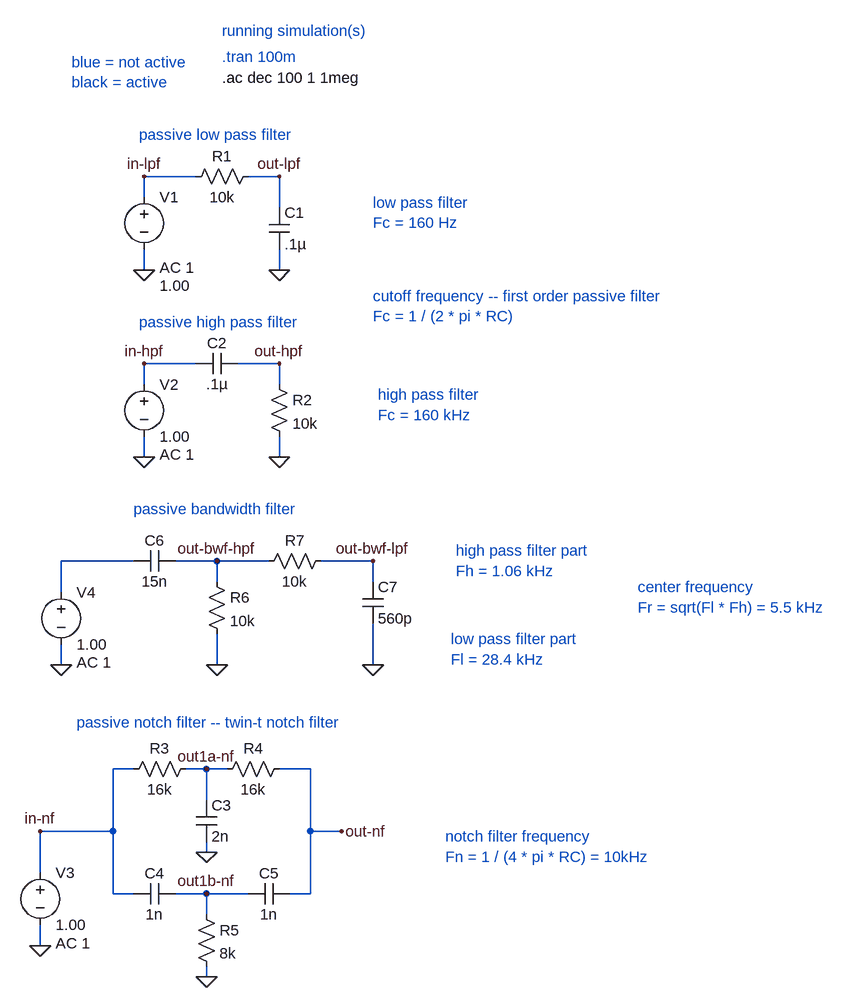
[diagram p0: schematic basic-passive-filters.asc]
basic-passive-filters.asc, the LTspice schematic file:
Version 4.1
SHEET 1 1164 1828
WIRE 144 64 64 64
WIRE 272 64 224 64
WIRE 64 96 64 64
WIRE 272 112 272 64
WIRE 64 208 64 176
WIRE 272 208 272 176
WIRE 144 352 64 352
WIRE 272 352 208 352
WIRE 64 384 64 352
WIRE 272 384 272 352
WIRE 64 496 64 464
WIRE 272 496 272 464
WIRE 48 656 -64 656
WIRE 176 656 112 656
WIRE 256 656 176 656
WIRE 416 656 336 656
WIRE 176 688 176 656
WIRE 416 688 416 656
WIRE -64 704 -64 656
WIRE -64 816 -64 784
WIRE 176 816 176 768
WIRE 416 816 416 752
WIRE 48 976 16 976
WIRE 160 976 128 976
WIRE 192 976 160 976
WIRE 320 976 272 976
WIRE 160 1024 160 976
WIRE 16 1072 16 976
WIRE 16 1072 -96 1072
WIRE 320 1072 320 976
WIRE 368 1072 320 1072
WIRE 160 1104 160 1088
WIRE -96 1136 -96 1072
WIRE 16 1168 16 1072
WIRE 48 1168 16 1168
WIRE 160 1168 112 1168
WIRE 224 1168 160 1168
WIRE 320 1168 320 1072
WIRE 320 1168 288 1168
WIRE 160 1200 160 1168
WIRE -96 1248 -96 1216
WIRE 160 1296 160 1280
FLAG 64 208 0
FLAG 272 208 0
FLAG 272 64 out-lpf
FLAG 64 496 0
FLAG 272 496 0
FLAG 272 352 out-hpf
FLAG 64 64 in-lpf
FLAG 64 352 in-hpf
FLAG 160 1104 0
FLAG 160 1296 0
FLAG -96 1248 0
FLAG 368 1072 out-nf
FLAG -96 1072 in-nf
FLAG 160 976 out1a-nf
FLAG 160 1168 out1b-nf
FLAG -64 816 0
FLAG 176 816 0
FLAG 416 816 0
FLAG 416 656 out-bwf-lpf
FLAG 176 656 out-bwf-hpf
SYMBOL voltage 64 80 R0
WINDOW 3 24 152 Left 2
WINDOW 123 24 124 Left 2
WINDOW 39 0 0 Left 0
SYMATTR InstName V1
SYMATTR Value 1.00
SYMATTR Value2 AC 1
SYMBOL res 240 48 R90
WINDOW 0 0 56 VBottom 2
WINDOW 3 32 56 VTop 2
SYMATTR InstName R1
SYMATTR Value 10k
SYMBOL cap 256 112 R0
SYMATTR InstName C1
SYMATTR Value .1µ
SYMBOL voltage 64 368 R0
WINDOW 123 24 124 Left 2
WINDOW 39 0 0 Left 0
SYMATTR InstName V2
SYMATTR Value 1.00
SYMATTR Value2 AC 1
SYMBOL cap 208 336 R90
WINDOW 0 0 32 VBottom 2
WINDOW 3 32 32 VTop 2
SYMATTR InstName C2
SYMATTR Value .1µ
SYMBOL res 256 368 R0
SYMATTR InstName R2
SYMATTR Value 10k
SYMBOL voltage -96 1120 R0
WINDOW 123 24 124 Left 2
WINDOW 39 0 0 Left 0
SYMATTR InstName V3
SYMATTR Value 1.00
SYMATTR Value2 AC 1
SYMBOL res 144 960 R90
WINDOW 0 0 56 VBottom 2
WINDOW 3 32 56 VTop 2
SYMATTR InstName R3
SYMATTR Value 16k
SYMBOL res 288 960 R90
WINDOW 0 0 56 VBottom 2
WINDOW 3 32 56 VTop 2
SYMATTR InstName R4
SYMATTR Value 16k
SYMBOL cap 144 1024 R0
SYMATTR InstName C3
SYMATTR Value 2n
SYMBOL cap 112 1152 R90
WINDOW 0 0 32 VBottom 2
WINDOW 3 32 32 VTop 2
SYMATTR InstName C4
SYMATTR Value 1n
SYMBOL cap 288 1152 R90
WINDOW 0 0 32 VBottom 2
WINDOW 3 32 32 VTop 2
SYMATTR InstName C5
SYMATTR Value 1n
SYMBOL res 144 1184 R0
SYMATTR InstName R5
SYMATTR Value 8k
SYMBOL voltage -64 688 R0
WINDOW 123 24 124 Left 2
WINDOW 39 0 0 Left 0
SYMATTR InstName V4
SYMATTR Value 1.00
SYMATTR Value2 AC 1
SYMBOL cap 112 640 R90
WINDOW 0 0 32 VBottom 2
WINDOW 3 32 32 VTop 2
SYMATTR InstName C6
SYMATTR Value 15n
SYMBOL res 160 672 R0
SYMATTR InstName R6
SYMATTR Value 10k
SYMBOL res 352 640 R90
WINDOW 0 0 56 VBottom 2
WINDOW 3 32 56 VTop 2
SYMATTR InstName R7
SYMATTR Value 10k
SYMBOL cap 400 688 R0
SYMATTR InstName C7
SYMATTR Value 560p
TEXT 56 0 Left 2 ;passive low pass filter
TEXT 56 288 Left 2 ;passive high pass filter
TEXT -40 904 Left 2 ;passive notch filter -- twin-t notch filter
TEXT 184 -120 Left 2 ;.tran 100m
TEXT 184 -160 Left 2 ;running simulation(s)
TEXT 184 -88 Left 2 !.ac dec 100 1 1meg
TEXT 48 576 Left 2 ;passive bandwidth filter
TEXT -48 -112 Left 2 ;blue = not active\nblack = active
TEXT 416 248 Left 2 ;cutoff frequency -- first order passive filter\nFc = 1 / (2 * pi * RC)
TEXT 824 696 Left 2 ;center frequency\nFr = sqrt(Fl * Fh) = 5.5 kHz
TEXT 528 1080 Left 2 ;notch filter frequency\nFn = 1 / (4 * pi * RC) = 10kHz
TEXT 416 104 Left 2 ;low pass filter\nFc = 160 Hz
TEXT 424 400 Left 2 ;high pass filter\nFc = 160 kHz
TEXT 544 640 Left 2 ;high pass filter part\nFh = 1.06 kHz
TEXT 536 776 Left 2 ;low pass filter part\nFl = 28.4 kHz

The netlist it stands for:
* basic-passive-filters.asc
V1 in-lpf 0 1.00 AC 1
R1 out-lpf in-lpf 10k
C1 out-lpf 0 .1µ
V2 in-hpf 0 1.00 AC 1
C2 out-hpf in-hpf .1µ
R2 out-hpf 0 10k
V3 in-nf 0 1.00 AC 1
R3 out1a-nf in-nf 16k
R4 out-nf out1a-nf 16k
C3 out1a-nf 0 2n
C4 out1b-nf in-nf 1n
C5 out-nf out1b-nf 1n
R5 out1b-nf 0 8k
V4 N001 0 1.00 AC 1
C6 out-bwf-hpf N001 15n
R6 out-bwf-hpf 0 10k
R7 out-bwf-lpf out-bwf-hpf 10k
C7 out-bwf-lpf 0 560p
* passive low pass filter
* passive high pass filter
* passive notch filter -- twin-t notch filter
* .tran 100m
* running simulation(s)
.ac dec 100 1 1meg
* passive bandwidth filter
* blue = not active
* black = active
* cutoff frequency -- first order passive filter
* Fc = 1 / (2 * pi * RC)
* center frequency
* Fr = sqrt(Fl * Fh) = 5.5 kHz
* notch filter frequency
* Fn = 1 / (4 * pi * RC) = 10kHz
* low pass filter
* Fc = 160 Hz
* high pass filter
* Fc = 160 kHz
* high pass filter part
* Fh = 1.06 kHz
* low pass filter part
* Fl = 28.4 kHz
.backanno
.end